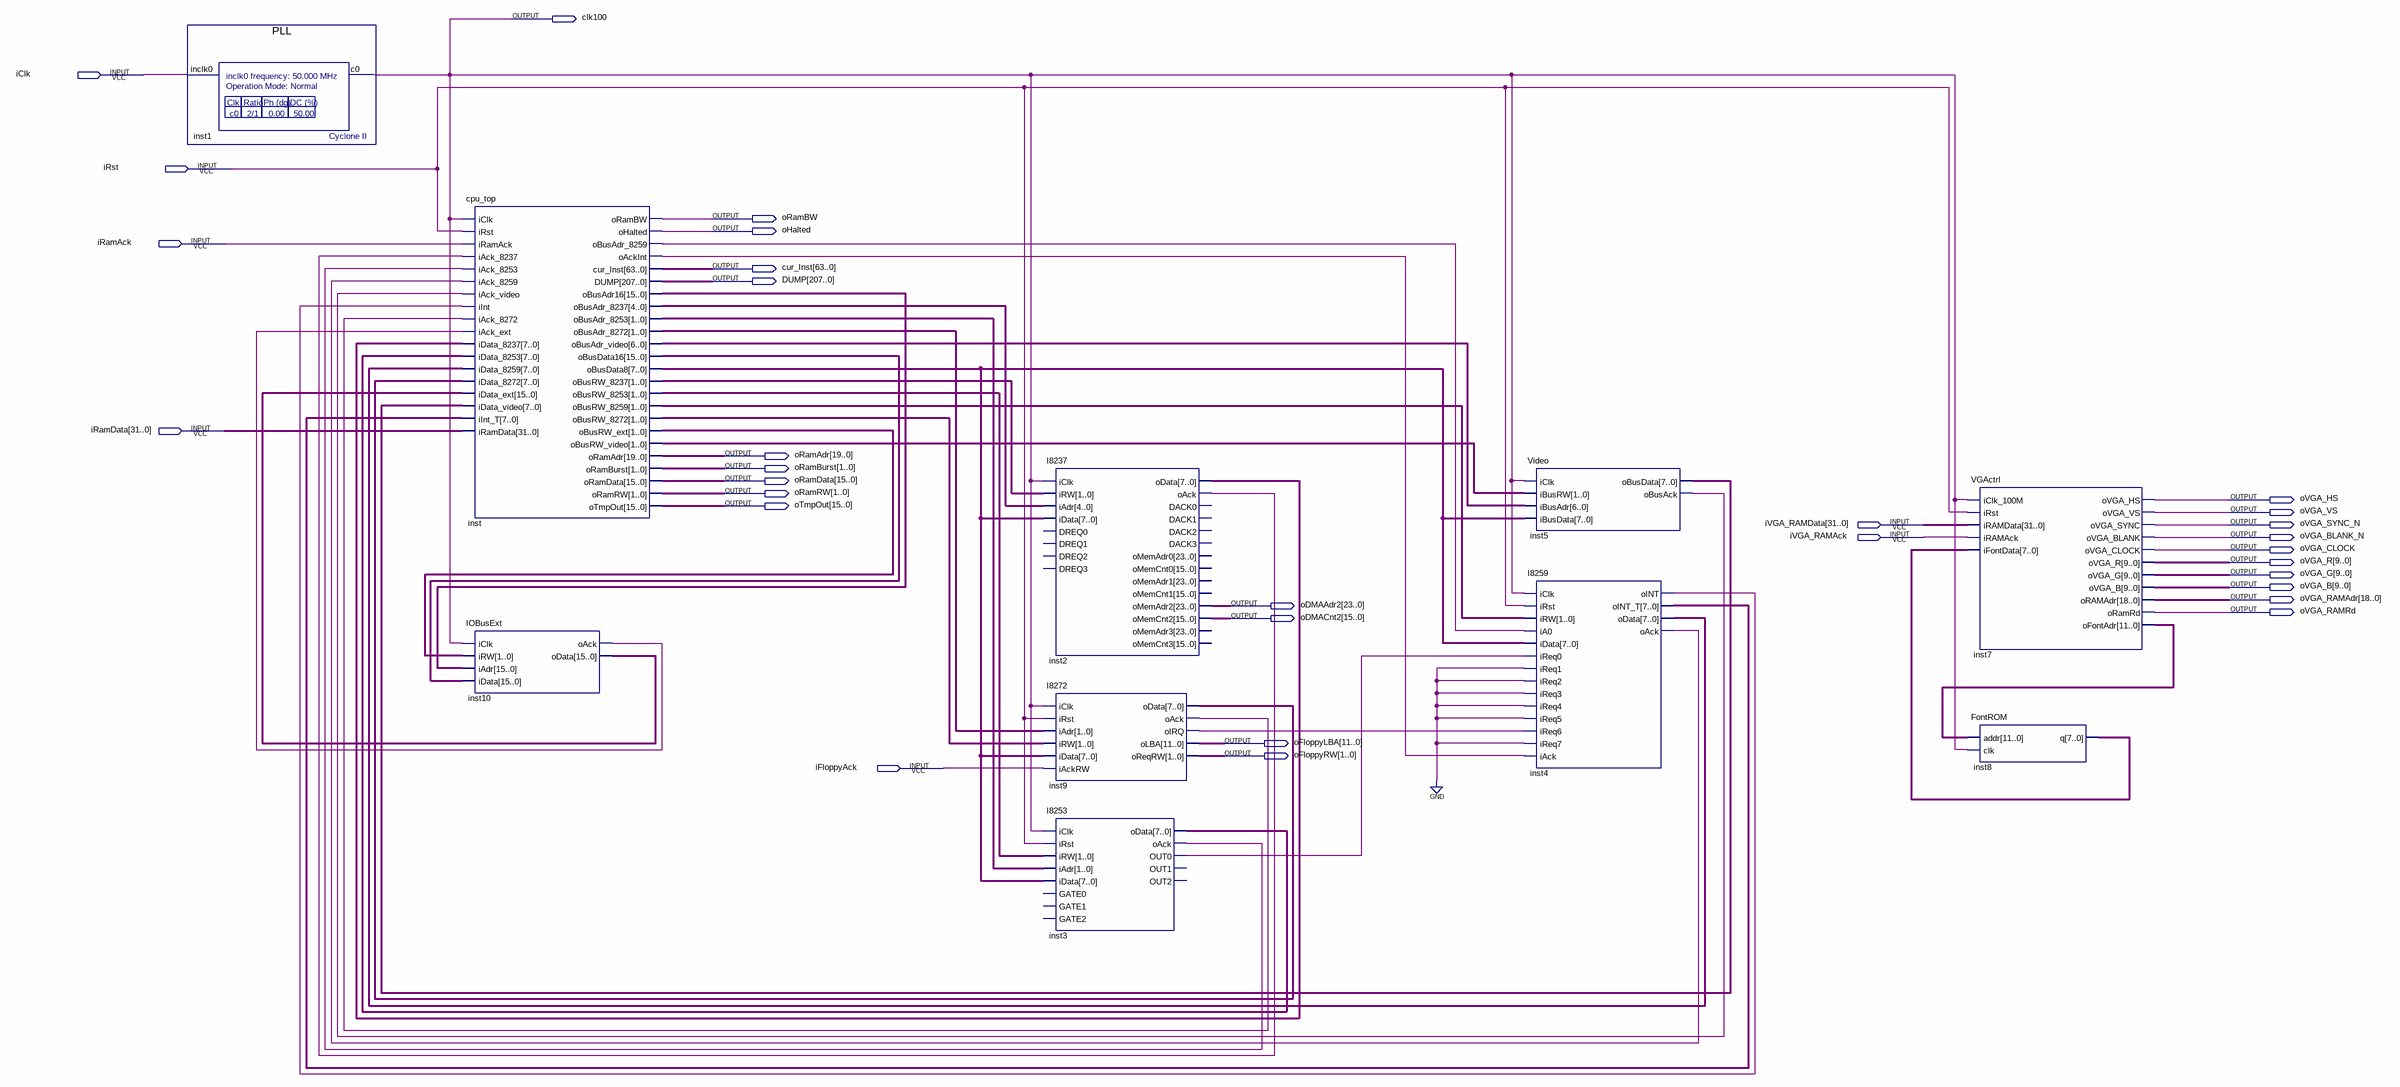
[diagram p0: schematic sheet]
// Quartus schematic OSOC86_soc.bdf as structural Verilog: 10 symbols, 31 pins
module OSOC86_soc (
  input  iClk,
  input  iRst,
  input  iRamAck,
  input  [31:0] iRamData,
  input  [31:0] iVGA_RAMData,
  input  iVGA_RAMAck,
  input  iFloppyAck,
  output clk100,
  output oRamBW,
  output oHalted,
  output [63:0] cur_Inst,
  output [207:0] DUMP,
  output [19:0] oRamAdr,
  output [1:0] oRamBurst,
  output [15:0] oRamData,
  output [1:0] oRamRW,
  output oVGA_HS,
  output [15:0] oTmpOut,
  output oVGA_VS,
  output oVGA_SYNC_N,
  output oVGA_BLANK_N,
  output oVGA_CLOCK,
  output [9:0] oVGA_R,
  output [9:0] oVGA_G,
  output [9:0] oVGA_B,
  output [18:0] oVGA_RAMAdr,
  output [23:0] oDMAAdr2,
  output oVGA_RAMRd,
  output [15:0] oDMACnt2,
  output [11:0] oFloppyLBA,
  output [1:0] oFloppyRW
);

  wire inst2_oack, inst3_oack, inst3_out0, inst4_oack, inst4_oint, inst5_obusack, inst9_oack, inst9_oirq,
       inst10_oack, inst_oackint, inst_obusadr_8259;
  wire [1:0] inst_obusadr_8253, inst_obusadr_8272, inst_obusrw_8237, inst_obusrw_8253, inst_obusrw_8259,
       inst_obusrw_8272, inst_obusrw_ext, inst_obusrw_video;
  wire [4:0] inst_obusadr_8237;
  wire [6:0] inst_obusadr_video;
  wire [7:0] inst2_odata, inst3_odata, inst4_odata, inst4_oint_t, inst5_obusdata, inst8_q, inst9_odata,
       inst_obusdata8;
  wire [11:0] inst7_ofontadr;
  wire [15:0] inst10_odata, inst_obusadr16, inst_obusdata16;

  PLL inst1 (.inclk0(iClk), .c0(clk100));
  cpu_top inst (
    .iClk(clk100), .iRst(iRst), .iRamAck(iRamAck), .iAck_8237(inst2_oack), .iAck_8253(inst3_oack),
    .iAck_8259(inst4_oack), .iAck_video(inst5_obusack), .iInt(inst4_oint), .iAck_8272(inst9_oack),
    .iAck_ext(inst10_oack), .iData_8237(inst2_odata), .iData_8253(inst3_odata), .iData_8259(inst4_odata),
    .iData_8272(inst9_odata), .iData_ext(inst10_odata), .iData_video(inst5_obusdata), .iInt_T(inst4_oint_t),
    .iRamData(iRamData), .oRamBW(oRamBW), .oHalted(oHalted), .oBusAdr_8259(inst_obusadr_8259),
    .oAckInt(inst_oackint), .cur_Inst(cur_Inst), .DUMP(DUMP), .oBusAdr16(inst_obusadr16),
    .oBusAdr_8237(inst_obusadr_8237), .oBusAdr_8253(inst_obusadr_8253), .oBusAdr_8272(inst_obusadr_8272),
    .oBusAdr_video(inst_obusadr_video), .oBusData16(inst_obusdata16), .oBusData8(inst_obusdata8),
    .oBusRW_8237(inst_obusrw_8237), .oBusRW_8253(inst_obusrw_8253), .oBusRW_8259(inst_obusrw_8259),
    .oBusRW_8272(inst_obusrw_8272), .oBusRW_ext(inst_obusrw_ext), .oBusRW_video(inst_obusrw_video),
    .oRamAdr(oRamAdr), .oRamBurst(oRamBurst), .oRamData(oRamData), .oRamRW(oRamRW), .oTmpOut(oTmpOut));
  IOBusExt inst10 (
    .iClk(clk100), .iRW(inst_obusrw_ext), .iAdr(inst_obusadr16), .iData(inst_obusdata16), .oAck(inst10_oack),
    .oData(inst10_odata));
  I8237 inst2 (
    .iClk(clk100), .iRW(inst_obusrw_8237), .iAdr(inst_obusadr_8237), .iData(inst_obusdata8),
    .oData(inst2_odata), .oAck(inst2_oack), .oMemAdr2(oDMAAdr2), .oMemCnt2(oDMACnt2));  // open: DREQ0, DREQ1, DREQ2, DREQ3, DACK0, DACK1, DACK2, DACK3, oMemAdr0, oMemCnt0, oMemAdr1, oMemCnt1, oMemAdr3, oMemCnt3
  I8272 inst9 (
    .iClk(clk100), .iRst(iRst), .iAdr(inst_obusadr_8272), .iRW(inst_obusrw_8272), .iData(inst_obusdata8),
    .iAckRW(iFloppyAck), .oData(inst9_odata), .oAck(inst9_oack), .oIRQ(inst9_oirq), .oLBA(oFloppyLBA),
    .oReqRW(oFloppyRW));
  I8253 inst3 (
    .iClk(clk100), .iRst(iRst), .iRW(inst_obusrw_8253), .iAdr(inst_obusadr_8253), .iData(inst_obusdata8),
    .oData(inst3_odata), .oAck(inst3_oack), .OUT0(inst3_out0));  // open: GATE0, GATE1, GATE2, OUT1, OUT2
  Video inst5 (
    .iClk(clk100), .iBusRW(inst_obusrw_video), .iBusAdr(inst_obusadr_video), .iBusData(inst_obusdata8),
    .oBusData(inst5_obusdata), .oBusAck(inst5_obusack));
  I8259 inst4 (
    .iClk(clk100), .iRst(iRst), .iRW(inst_obusrw_8259), .iA0(inst_obusadr_8259), .iData(inst_obusdata8),
    .iReq0(inst3_out0), .iReq1(1'b0), .iReq2(1'b0), .iReq3(1'b0), .iReq4(1'b0), .iReq5(1'b0),
    .iReq6(inst9_oirq), .iReq7(1'b0), .iAck(inst_oackint), .oINT(inst4_oint), .oINT_T(inst4_oint_t),
    .oData(inst4_odata), .oAck(inst4_oack));
  VGActrl inst7 (
    .iClk_100M(clk100), .iRst(iRst), .iRAMData(iVGA_RAMData), .iRAMAck(iVGA_RAMAck), .iFontData(inst8_q),
    .oVGA_HS(oVGA_HS), .oVGA_VS(oVGA_VS), .oVGA_SYNC(oVGA_SYNC_N), .oVGA_BLANK(oVGA_BLANK_N),
    .oVGA_CLOCK(oVGA_CLOCK), .oVGA_R(oVGA_R), .oVGA_G(oVGA_G), .oVGA_B(oVGA_B), .oRAMAdr(oVGA_RAMAdr),
    .oRamRd(oVGA_RAMRd), .oFontAdr(inst7_ofontadr));
  FontROM inst8 (.addr(inst7_ofontadr), .clk(clk100), .q(inst8_q));
endmodule
